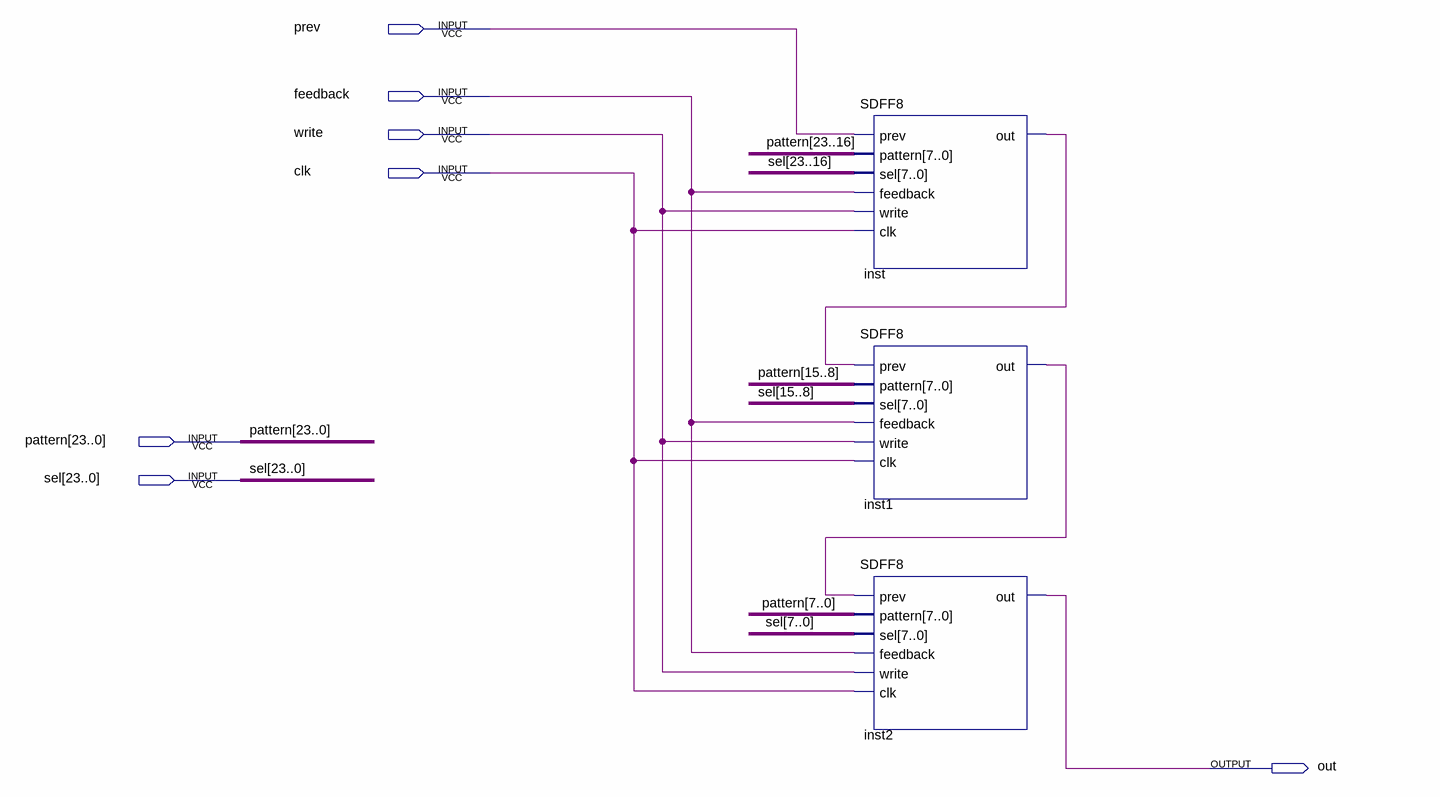
[diagram p0: schematic sheet]
// Quartus schematic SDFF24.bdf as structural Verilog: 3 symbols, 7 pins
module SDFF24 (
  input  prev,
  input  feedback,
  input  write,
  input  clk,
  input  [23:0] pattern,
  input  [23:0] sel,
  output out
);

  wire inst1_out, inst_out;

  SDFF8 inst (
    .prev(prev), .pattern(pattern[23:16]), .sel(sel[23:16]), .feedback(feedback), .write(write), .clk(clk),
    .out(inst_out));
  SDFF8 inst1 (
    .prev(inst_out), .pattern(pattern[15:8]), .sel(sel[15:8]), .feedback(feedback), .write(write), .clk(clk),
    .out(inst1_out));
  SDFF8 inst2 (
    .prev(inst1_out), .pattern(pattern[7:0]), .sel(sel[7:0]), .feedback(feedback), .write(write), .clk(clk),
    .out(out));
endmodule
